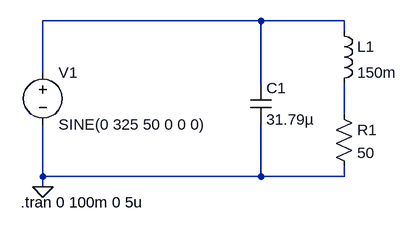
[diagram p0: schematic EEE_10_1.asc]
EEE_10_1.asc, the LTspice schematic file:
Version 4
SHEET 1 880 680
WIRE 336 48 0 48
WIRE 464 48 336 48
WIRE 464 64 464 48
WIRE 0 128 0 48
WIRE 336 144 336 48
WIRE 464 192 464 144
WIRE 0 288 0 208
WIRE 336 288 336 208
WIRE 336 288 0 288
WIRE 464 288 464 272
WIRE 464 288 336 288
WIRE 0 304 0 288
FLAG 0 304 0
SYMBOL voltage 0 112 R0
WINDOW 123 0 0 Left 0
WINDOW 39 0 0 Left 0
SYMATTR InstName V1
SYMATTR Value SINE(0 325 50 0 0 0)
SYMBOL ind 448 48 R0
SYMATTR InstName L1
SYMATTR Value 150m
SYMBOL res 448 176 R0
SYMATTR InstName R1
SYMATTR Value 50
SYMBOL cap 320 144 R0
SYMATTR InstName C1
SYMATTR Value 31.79µ
TEXT -34 328 Left 2 !.tran 0 100m 0 5u

The netlist it stands for:
* EEE_10_1.asc
V1 N001 0 SINE(0 325 50 0 0 0)
L1 N001 N002 150m
R1 N002 0 50
C1 N001 0 31.79µ
.tran 0 100m 0 5u
.backanno
.end